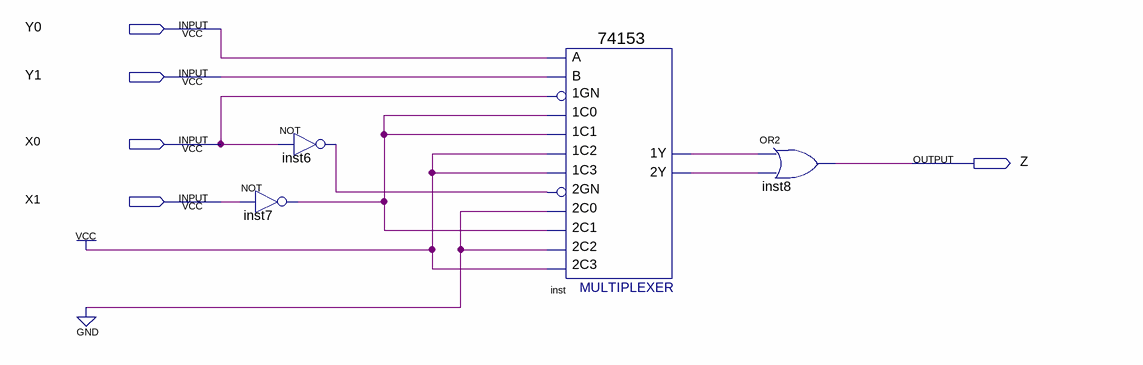
[diagram p0: schematic sheet]
// Quartus schematic Blood_Test.bdf as structural Verilog: 4 symbols, 5 pins
module Blood_Test (
  input  Y0,
  input  Y1,
  input  X0,
  input  X1,
  output Z
);

  wire inst6_out, inst7_out, inst_1y, inst_2y;

  not inst6 (inst6_out, X0);
  not inst7 (inst7_out, X1);
  \74153  inst (
    .\1C1 (inst7_out), .\1GN (X0), .\1C0 (inst7_out), .\2C0 (1'b0), .\2GN (inst6_out), .\2C2 (1'b0),
    .\1C2 (1'b1), .\1C3 (1'b1), .B(Y1), .A(Y0), .\2C1 (inst7_out), .\2C3 (1'b1), .\1Y (inst_1y),
    .\2Y (inst_2y));
  or inst8 (Z, inst_1y, inst_2y);
endmodule
